# Altium schematic sheet peripheral.SchDoc: "NAME HERE "
size A3; Author: mayerph; DrawnBy: mayerph; Organization: IIS; Revision: PA; SheetNumber: 3; SheetTotal: 3
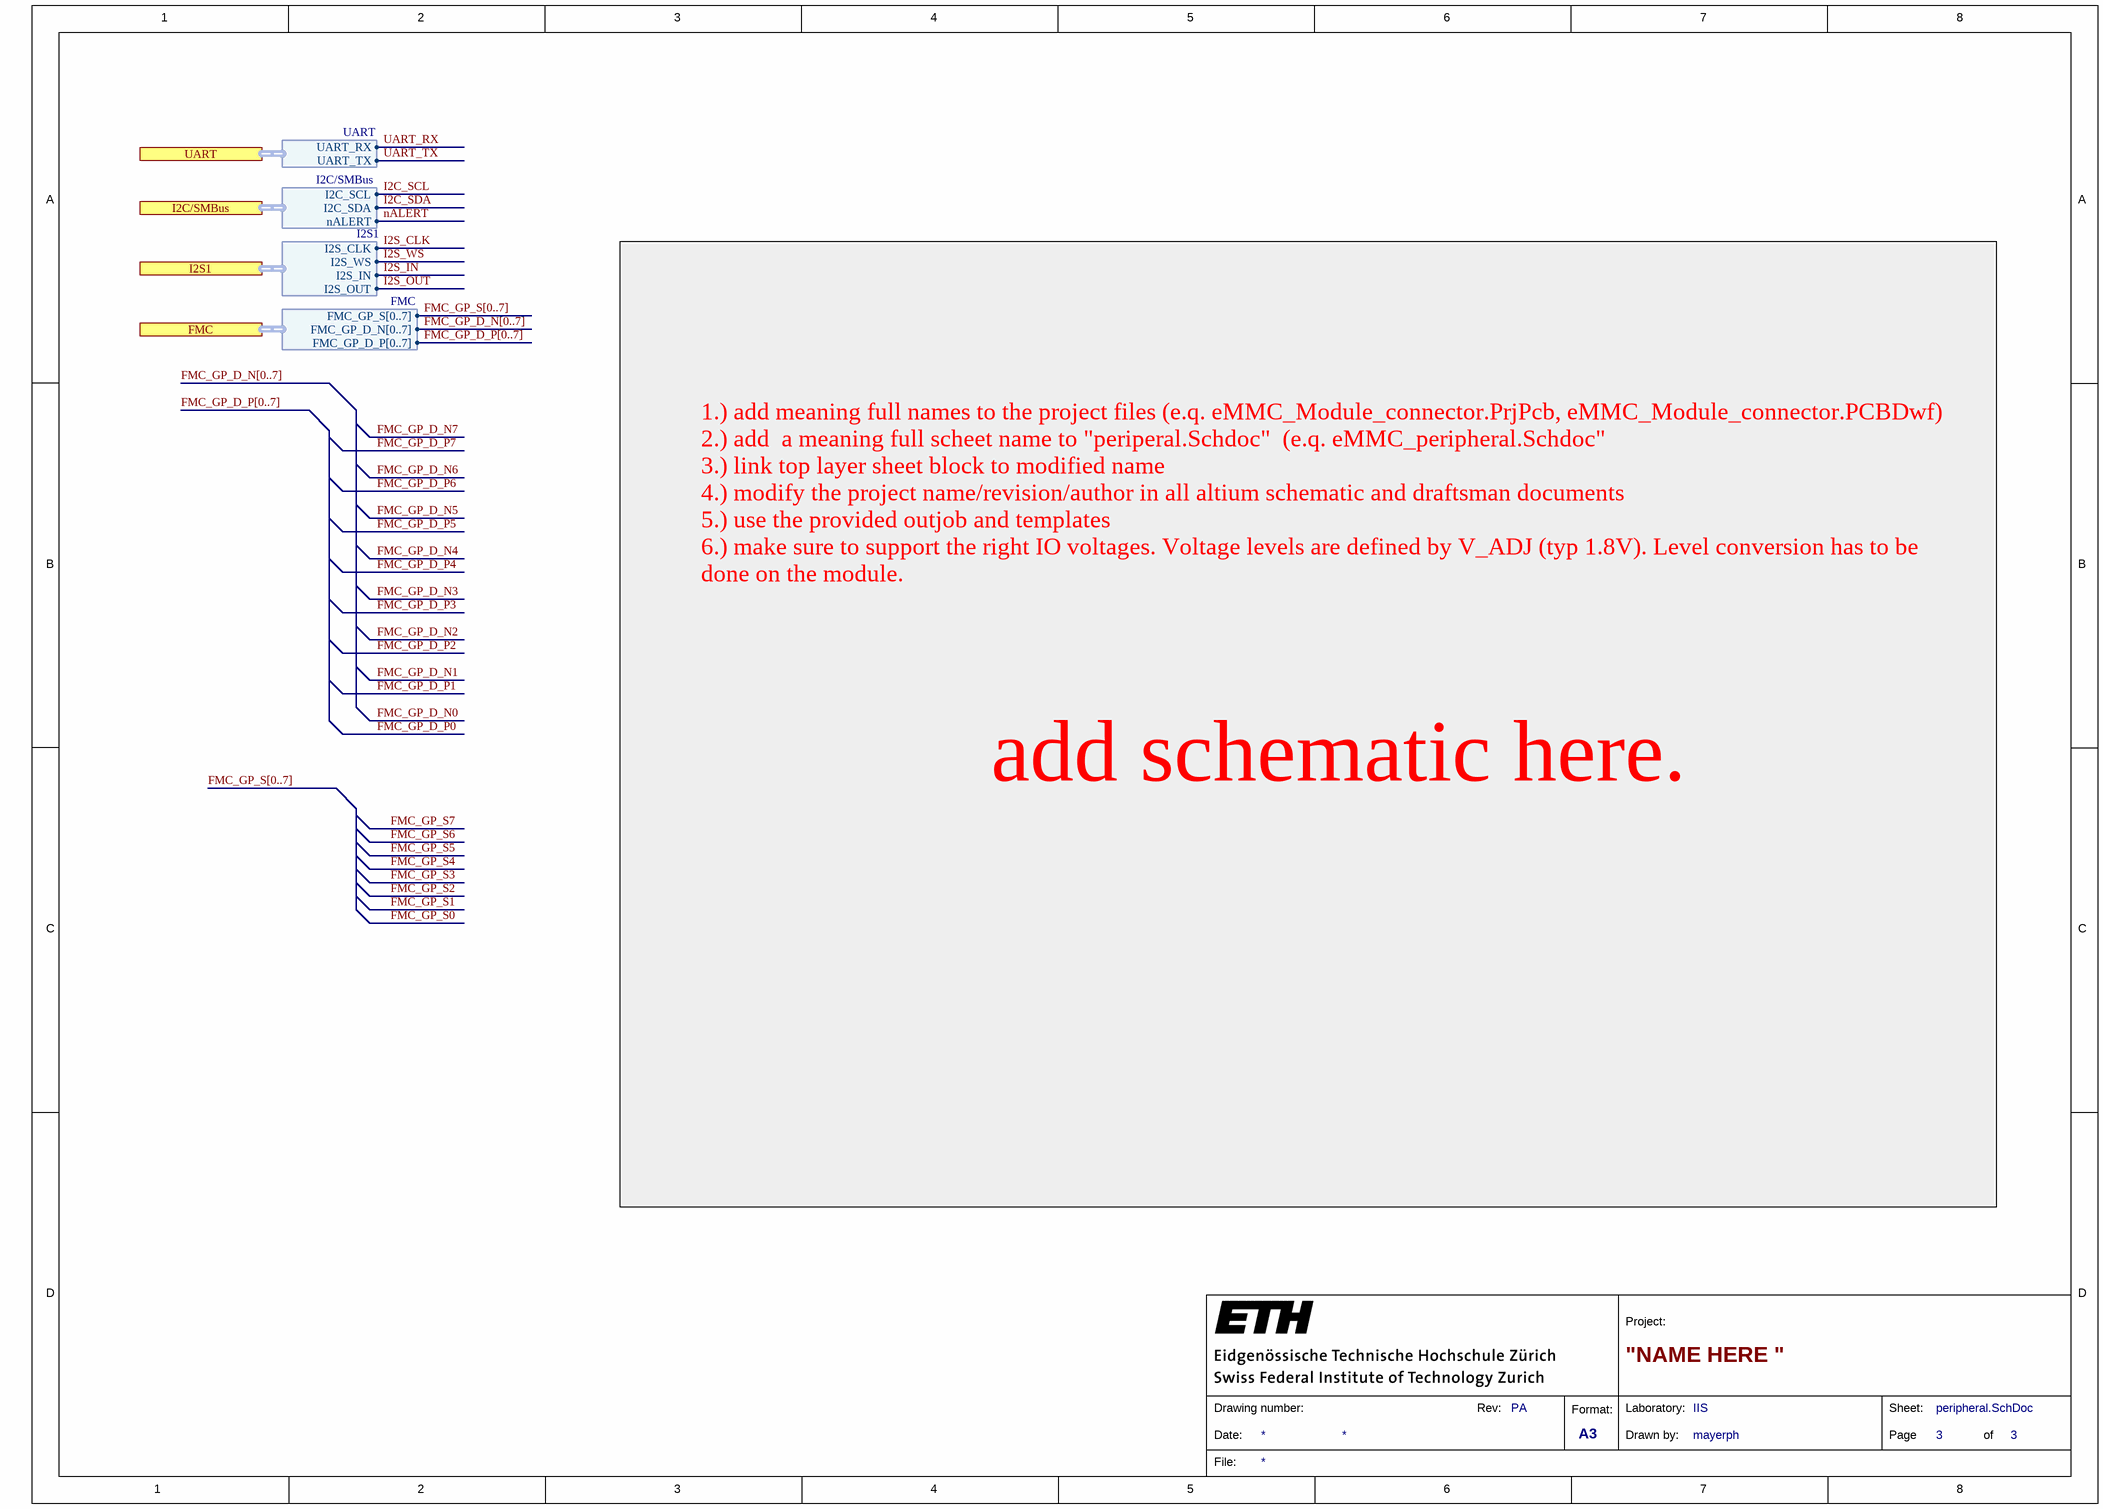
[diagram p0: peripheral.SchDoc]

## Ports
FMC (harness FMC), I2C/SMBus (harness I2C/SMBus), I2S1 (harness I2S1), UART (harness UART)

## Harnesses
I2C/SMBus: I2C_SDA, I2C_SCL, nALERT
UART: UART_TX, UART_RX
I2S1: I2S_OUT, I2S_IN, I2S_WS, I2S_CLK
FMC: FMC_GP_D_N[0..7], FMC_GP_S[0..7], FMC_GP_D_P[0..7]

## Nets
I2C_SCL: port I2C/SMBus.I2C_SCL
I2C_SDA: port I2C/SMBus.I2C_SDA
I2S_CLK: port I2S1.I2S_CLK
I2S_IN: port I2S1.I2S_IN
I2S_OUT: port I2S1.I2S_OUT
I2S_WS: port I2S1.I2S_WS
nALERT: port I2C/SMBus.nALERT
UART_RX: port UART.UART_RX
UART_TX: port UART.UART_TX

## Buses and harness runs
bus FMC_GP_D_N[0..7]
bus FMC_GP_D_P[0..7]
bus FMC_GP_S[0..7]

## Notes on the sheet
- 1.) add meaning full names to the project files (e.q. eMMC_Module_connector.PrjPcb, eMMC_Module_connector.PCBDwf)
  2.) add  a meaning full scheet name to "periperal.Schdoc"  (e.q. eMMC_peripheral.Schdoc"
  3.) link top layer sheet block to modified name
  4.) modify the project name/revision/author in all altium schematic and draftsman documents
  5.) use the provided outjob and templates
  6.) make sure to support the right IO voltages. Voltage levels are defined by V_ADJ (typ 1.8V). Level conversion has to be done on the module.
- add schematic here.
- 1
- 2
- 3
- 4
- 5
- 6
- 7
- 8
- A
- B
- C
- D
- Project:
- Date:
- Drawing number:
- Rev:
- Format:
- A3
- Drawn by:
- Laboratory:
- Page
- Sheet:
- of
- File: